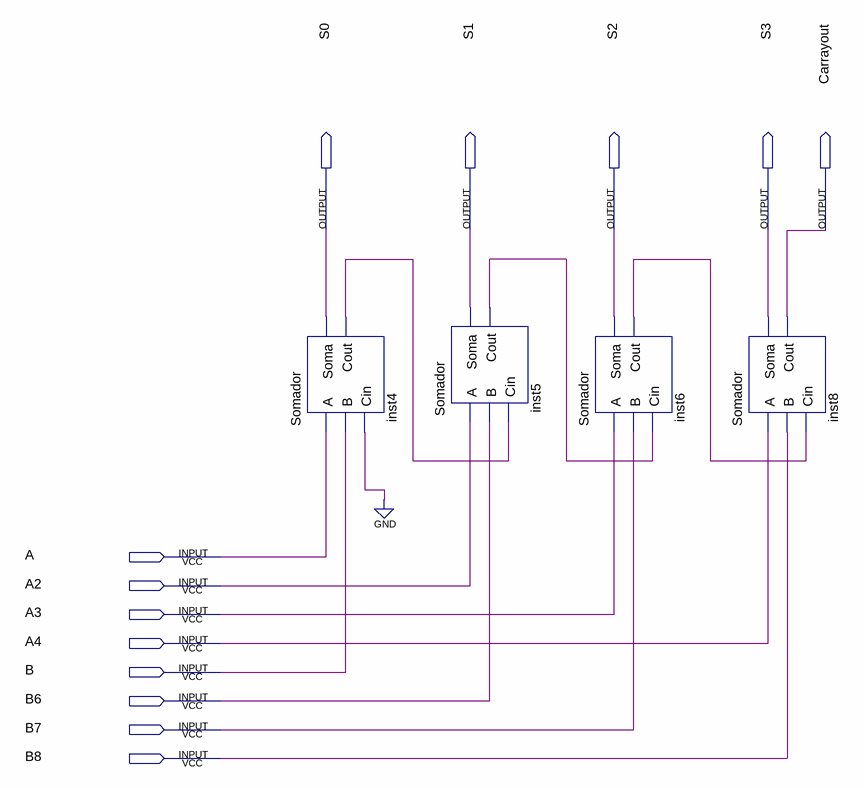
[diagram p0: schematic sheet]
// Quartus schematic Fulladder.bdf as structural Verilog: 4 symbols, 13 pins
module Fulladder (
  input  A,
  input  A2,
  input  A3,
  input  A4,
  input  B,
  input  B6,
  input  B7,
  input  B8,
  output S0,
  output S1,
  output S2,
  output S3,
  output Carrayout
);

  wire inst4_cout, inst5_cout, inst6_cout;

  Somador inst4 (.A(A), .B(B), .Cin(1'b0), .Soma(S0), .Cout(inst4_cout));
  Somador inst5 (.A(A2), .B(B6), .Cin(inst4_cout), .Soma(S1), .Cout(inst5_cout));
  Somador inst6 (.A(A3), .B(B7), .Cin(inst5_cout), .Soma(S2), .Cout(inst6_cout));
  Somador inst8 (.A(A4), .B(B8), .Cin(inst6_cout), .Soma(S3), .Cout(Carrayout));
endmodule
